# Altium schematic sheet UV_Disinfection_Relay_Hw00.SchDoc
size A
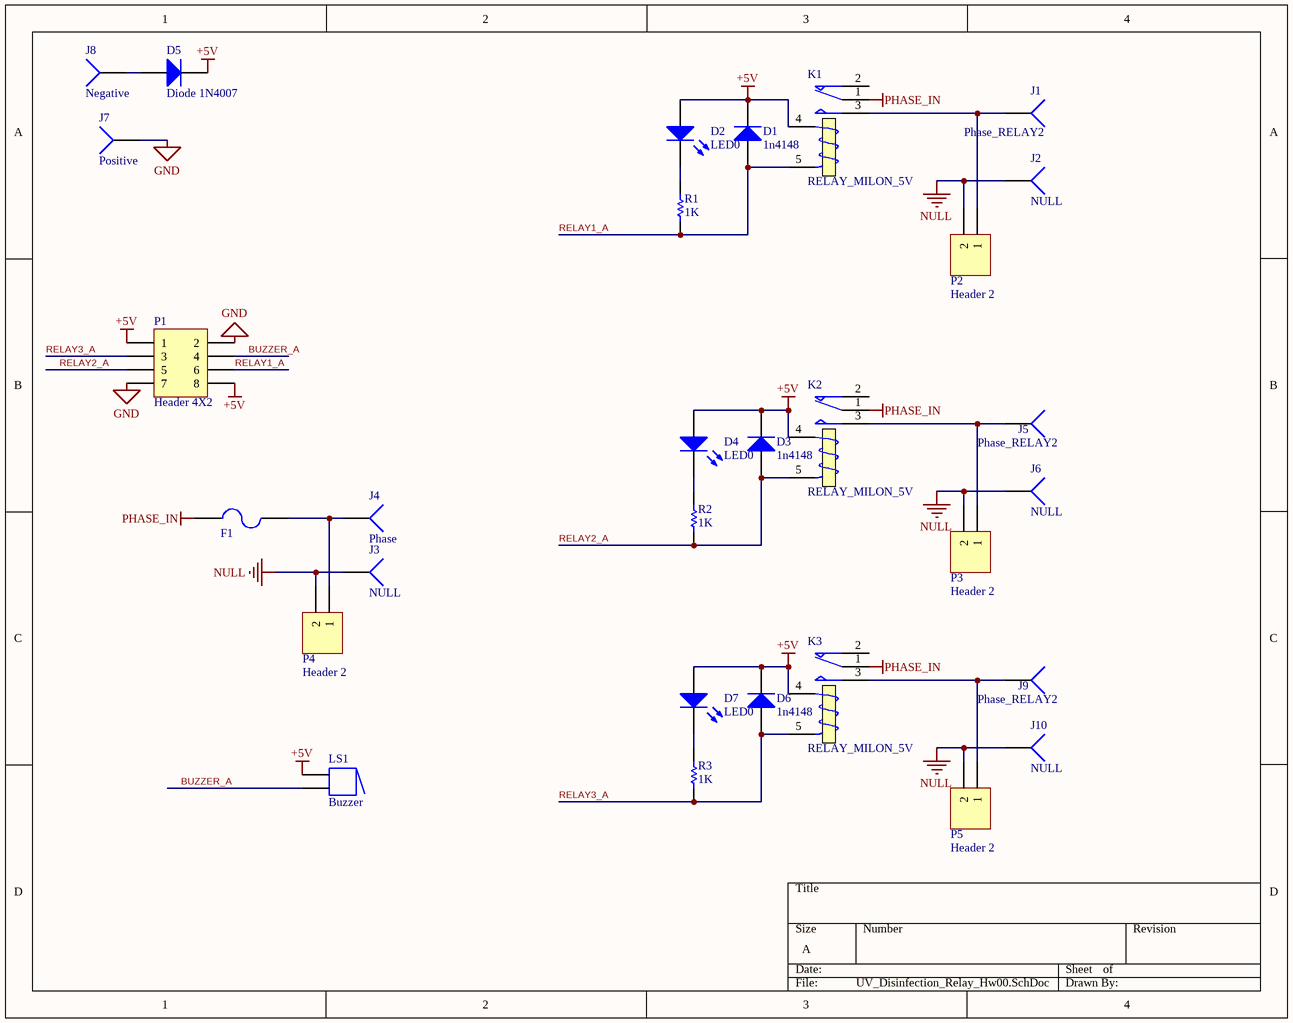
[diagram p0: UV_Disinfection_Relay_Hw00.SchDoc]

## Parts
D1  1n4148  [DO 35]
D2  LED0  [LED5MM_GRN]
D3  1n4148  [DO 35]
D4  LED0  [LED5MM_GRN]
D5  Diode 1N4007  [DO-201AD - vertical]
D6  1n4148  [DO 35]
D7  LED0  [LED5MM_GRN]
F1  F=1.0 A  [Fuse 5x20]  (value not drawn)
J1  Phase_RELAY2  [COOLER_TEMINAL_M_6.3mm]
J2  NULL  [COOLER_TEMINAL_M_6.3mm]
J3  NULL  [COOLER_TEMINAL_M_6.3mm]
J4  Phase  [COOLER_TEMINAL_M_6.3mm]
J5  Phase_RELAY2  [COOLER_TEMINAL_M_6.3mm]
J6  NULL  [COOLER_TEMINAL_M_6.3mm]
J7  Positive  [COOLER_TEMINAL_M_6.3mm]
J8  Negative  [COOLER_TEMINAL_M_6.3mm]
J9  Phase_RELAY2  [COOLER_TEMINAL_M_6.3mm]
J10  NULL  [COOLER_TEMINAL_M_6.3mm]
K1  RELAY_MILON_5V  [Relay 18.85x15.35x15.70]
K2  RELAY_MILON_5V  [Relay 18.85x15.35x15.70]
K3  RELAY_MILON_5V  [Relay 18.85x15.35x15.70]
LS1  Buzzer  [BUZZER_12A05]
P1  Header 4X2  [HDR2X4]
P2  Header 2  [MSTB 2,5/2-G-5,08]
P3  Header 2  [MSTB 2,5/2-G-5,08]
P4  Header 2  [MSTB 2,5/2-G-5,08]
P5  Header 2  [MSTB 2,5/2-G-5,08]
R1  1K  [Axial 0_25w_2_54mm]
R2  1K  [Axial 0_25w_2_54mm]
R3  1K  [Axial 0_25w_2_54mm]

## Nets
+5V: D1.2(K) D2.1(A) D3.2(K) D4.1(A) D5.2(K) D6.2(K) D7.1(A) K1.4(T1) K2.4(T1) K3.4(T1) LS1.1 P1.1 P1.8
GND: J7.1 P1.2 P1.7
NULL: J2.1 J3.1 J6.1 J10.1 P2.2 P3.2 P4.2 P5.2
PHASE_IN: F1.1 K1.1(COM) K2.1(COM) K3.1(COM)
BUZZER_A: LS1.2 P1.4
RELAY1_A: D1.1(A) K1.5(T2) P1.6 R1.1
RELAY2_A: D3.1(A) K2.5(T2) P1.5 R2.1
RELAY3_A: D6.1(A) K3.5(T2) P1.3 R3.1
NetD2_2: D2.2(K) R1.2
NetD4_2: D4.2(K) R2.2
NetD5_1: D5.1(A) J8.1
NetD7_2: D7.2(K) R3.2
NetF1_2: F1.2 J4.1 P4.1
NetJ1_1: J1.1 K1.3(NO) P2.1
NetJ5_1: J5.1 K2.3(NO) P3.1
NetJ9_1: J9.1 K3.3(NO) P5.1

Not connected (* = marked no-connect by the designer): K1 2(NC); K2 2(NC); K3 2(NC)

## Library data of the parts
D1 D3 D5 D6 = Diode 1N4007: 1 Amp General Purpose Rectifier; Published: 8-Jun-2000; LatestRevisionDate: 17-Jul-2002; LatestRevisionNote: Re-released for DXP Platform.; DatasheetVersion: 1998; PackageVersion: Aug-1999; PackageReference: DO-41; Publisher: Altium Limited; PackageDescription: Diode, Axial; Body 5.2 x 2.7 mm (LxDia. max), Lead Dia. 0.86 mm (max); Code_JEDEC: DO-204-AL; ComponentLink1Description: Manufacturer Link; ComponentLink1URL: http://www.fairchildsemi.com/; ComponentLink2Description: Datasheet; ComponentLink2URL: http://www.fairchildsemi.com/ds/1N%2F1N4001.pdf
D2 D4 D7 = LED0: Typical INFRARED GaAs LED; Published: 8-Jun-2000; LatestRevisionDate: 08-Jul-2005; LatestRevisionNote: Mech Layer 1 removed.; PackageReference: LED-0; Publisher: Altium Limited; PackageDescription: LED; 2 Leads
F1 = Fuse 5x20 with holdeer pins: Fuses 5x20; Designer: Abbas Basereh; Desc.: fuse with holder pins 5x20; Data: 28-12-2016
J1-J10 = Socket: LatestRevisionDate: 17-Jul-2002; LatestRevisionNote: Re-released for DXP Platform.; Publisher: Altium Limited
K1-K3 = Relay_SPDT: RELAY 5V 7A 1C 5PIN; Designer: Abbas Basereh; Mounting Technology: Through-Hole; ComponentLink1Description: Datasheet; Pin Count: 0; Update Date: 2017-3-1
LS1 = Buzzer: Magnetic Transducer Buzzer; Published: 24-Mar-1999; LatestRevisionDate: 17-Dec-2003; LatestRevisionNote: Schematic revised, PCB Footprint replaced.; DatasheetVersion: 17-Dec-2003; PackageReference: ABSM-1574; Publisher: Altium Limited; PackageDescription: Magnetic Transducer Buzzer; ComponentLink1Description: Manufacturer Link; ComponentLink1URL: http://www.megastar.com/linecard/buzzmode/index.php
P1 = Header 4X2: Header, 4-Pin, Dual row; LatestRevisionDate: 17-Jul-2002; LatestRevisionNote: Re-released for DXP Platform.; Publisher: Altium Limited
P2-P5 = Header 2: Header, 2-Pin; LatestRevisionDate: 17-Jul-2002; LatestRevisionNote: Re-released for DXP Platform.; Publisher: Altium Limited
R1-R3 = Res1: Resistor; Published: 8-Jun-2000; LatestRevisionDate: 17-Jul-2002; LatestRevisionNote: Re-released for DXP Platform.; PackageReference: AXIAL-0.3; Publisher: Altium Limited; PackageDescription: Axial Device, Thru-Hole; 2 Leads; 0.3 in Pin Spacing; Value: 1K